# EAGLE design core09ss (EAGLE 6.6.0)

## Sheet 1 of 3
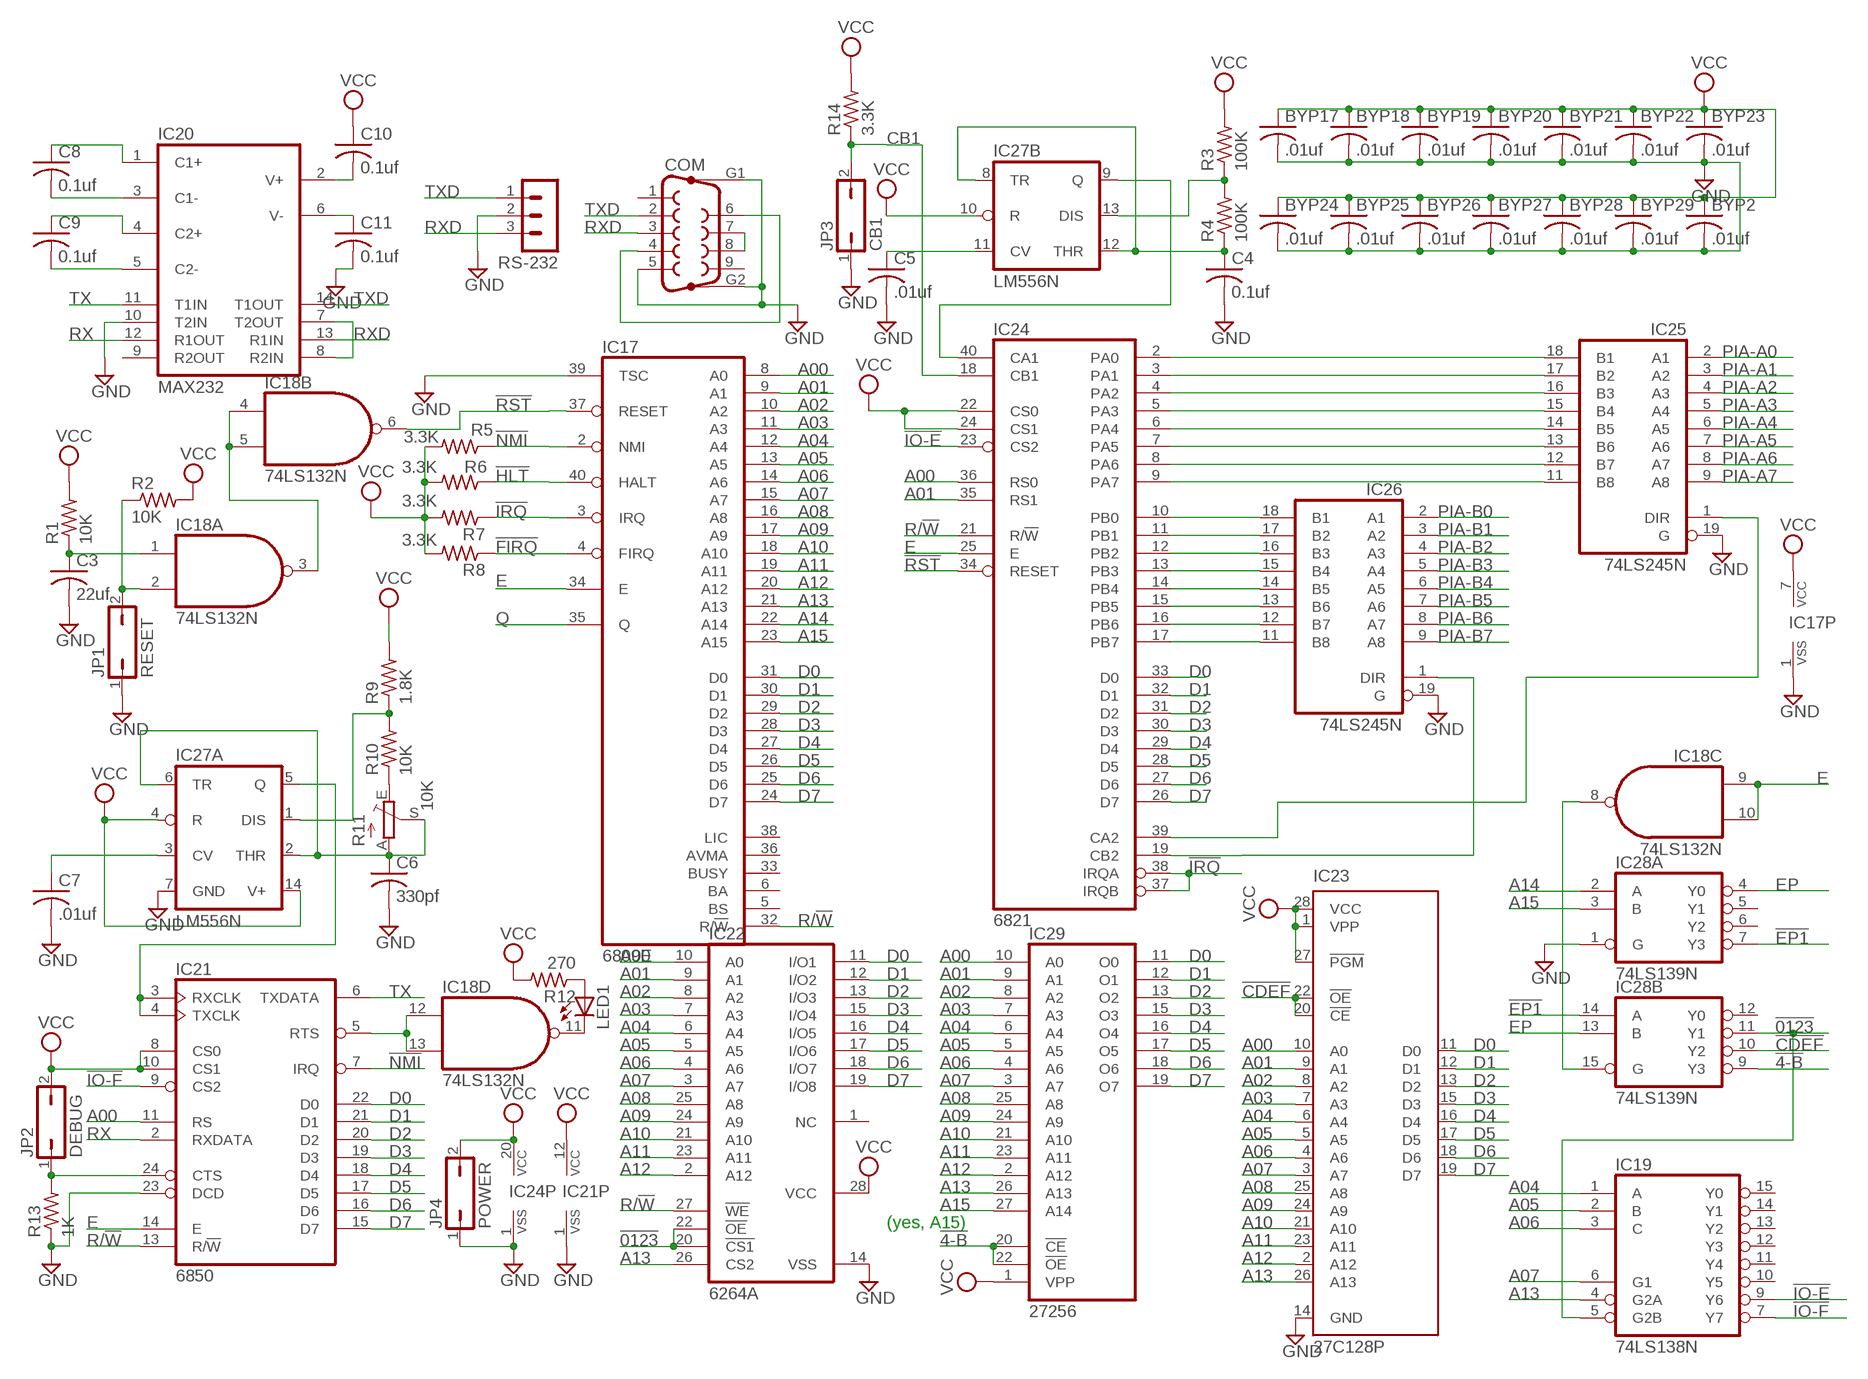
[diagram p0: schematic, sheet 1]

### Parts
BYP2  .01uf  C-US050-025X075  [C050-025X075]
BYP17  .01uf  C-US050-025X075  [C050-025X075]
BYP18  .01uf  C-US050-025X075  [C050-025X075]
BYP19  .01uf  C-US050-025X075  [C050-025X075]
BYP20  .01uf  C-US050-025X075  [C050-025X075]
BYP21  .01uf  C-US050-025X075  [C050-025X075]
BYP22  .01uf  C-US050-025X075  [C050-025X075]
BYP23  .01uf  C-US050-025X075  [C050-025X075]
BYP24  .01uf  C-US050-025X075  [C050-025X075]
BYP25  .01uf  C-US050-025X075  [C050-025X075]
BYP26  .01uf  C-US050-025X075  [C050-025X075]
BYP27  .01uf  C-US050-025X075  [C050-025X075]
BYP28  .01uf  C-US050-025X075  [C050-025X075]
BYP29  .01uf  C-US050-025X075  [C050-025X075]
C3  22uf  C-US102-043X133  [C102-043X133]
C4  0.1uf  C-US050-025X075  [C050-025X075]
C5  .01uf  C-US050-025X075  [C050-025X075]
C6  330pf  C-US050-025X075  [C050-025X075]
C7  .01uf  C-US050-025X075  [C050-025X075]
C8  0.1uf  C-US050-025X075  [C050-025X075]
C9  0.1uf  C-US050-025X075  [C050-025X075]
C10  0.1uf  C-US050-025X075  [C050-025X075]
C11  0.1uf  C-US050-025X075  [C050-025X075]
COM  F09HP  [F09HP]
IC17  6809E  [DIL40]
IC18  74LS132N  74LS00N  [DIL14]
IC19  74LS138N  [DIL16]
IC20  MAX232  [DIL16]
IC21  6850  [DIL24]
IC22  6264A  [DIL28-6]
IC23  27C128P  [DIL28-6]
IC24  6821  [DIL40]
IC25  74LS245N  [DIL20]
IC26  74LS245N  [DIL20]
IC27  LM556N  [DIL14]
IC28  74LS139N  [DIL16]
IC29  27256  [DIL28]
JP1  RESET  JP1Q  [JP1]
JP2  DEBUG  JP1Q  [JP1]
JP3  CB1  JP1Q  [JP1]
JP4  POWER  JP1Q  [JP1]
LED1  LED3MM  [LED3MM]
R1  10K  R-US_0207/7  [0207/7]
R2  10K  R-US_0207/7  [0207/7]
R3  100K  R-US_0207/7  [0207/7]
R4  100K  R-US_0207/7  [0207/7]
R5  3.3K  R-US_0207/7  [0207/7]
R6  3.3K  R-US_0207/7  [0207/7]
R7  3.3K  R-US_0207/7  [0207/7]
R8  3.3K  R-US_0207/7  [0207/7]
R9  1.8K  R-US_0207/7  [0207/7]
R10  10K  R-US_0207/7  [0207/7]
R11  10K  TRIM_EU-B90P  [SP19L]
R12  270  R-US_0207/7  [0207/7]
R13  1K  R-US_0207/7  [0207/7]
R14  3.3K  R-US_0207/7  [0207/7]
RS-232  MA03-1  [MA03-1]

### Nets
!4-B: IC28.9(B:Y3) IC29.20(!CE) IC29.22(!OE)
!0123: IC19.5(G2B) IC22.20(!CS1) IC22.22(!OE) IC28.11(B:Y1)
!CDEF: IC23.20(!CE) IC23.22(!OE) IC28.10(B:Y2)
!EP1: IC28.7(A:Y3) IC28.14(B:A)
!FIRQ: IC17.4(FIRQ) R8.1
!HLT: IC17.40(HALT) R5.1
!IO-E: IC19.9(Y6) IC24.23(CS2)
!IO-F: IC19.7(Y7) IC21.9(CS2)
!IRQ: IC17.3(IRQ) IC24.37(IRQB) IC24.38(IRQA) R7.1
!NMI: IC17.2(NMI) IC21.7(IRQ) R6.1
!RST: IC17.37(RESET) IC18.6(B:O) IC24.34(RESET)
A00: IC17.8(A0) IC21.11(RS) IC22.10(A0) IC23.10(A0) IC24.36(RS0) IC29.10(A0)
A01: IC17.9(A1) IC22.9(A1) IC23.9(A1) IC24.35(RS1) IC29.9(A1)
A02: IC17.10(A2) IC22.8(A2) IC23.8(A2) IC29.8(A2)
A03: IC17.11(A3) IC22.7(A3) IC23.7(A3) IC29.7(A3)
A04: IC17.12(A4) IC19.1(A) IC22.6(A4) IC23.6(A4) IC29.6(A4)
A05: IC17.13(A5) IC19.2(B) IC22.5(A5) IC23.5(A5) IC29.5(A5)
A06: IC17.14(A6) IC19.3(C) IC22.4(A6) IC23.4(A6) IC29.4(A6)
A07: IC17.15(A7) IC19.6(G1) IC22.3(A7) IC23.3(A7) IC29.3(A7)
A08: IC17.16(A8) IC22.25(A8) IC23.25(A8) IC29.25(A8)
A09: IC17.17(A9) IC22.24(A9) IC23.24(A9) IC29.24(A9)
A10: IC17.18(A10) IC22.21(A10) IC23.21(A10) IC29.21(A10)
A11: IC17.19(A11) IC22.23(A11) IC23.23(A11) IC29.23(A11)
A12: IC17.20(A12) IC22.2(A12) IC23.2(A12) IC29.2(A12)
A13: IC17.21(A13) IC19.4(G2A) IC22.26(CS2) IC23.26(A13) IC29.26(A13)
A14: IC17.22(A14) IC28.2(A:A)
A15: IC17.23(A15) IC28.3(A:B) IC29.27(A14)
CB1: IC24.18(CB1) JP3.2 R14.1
D0: IC17.31(D0) IC21.22(D0) IC22.11(I/O1) IC23.11(D0) IC24.33(D0) IC29.11(O0)
D1: IC17.30(D1) IC21.21(D1) IC22.12(I/O2) IC23.12(D1) IC24.32(D1) IC29.12(O1)
D2: IC17.29(D2) IC21.20(D2) IC22.13(I/O3) IC23.13(D2) IC24.31(D2) IC29.13(O2)
D3: IC17.28(D3) IC21.19(D3) IC22.15(I/O4) IC23.15(D3) IC24.30(D3) IC29.15(O3)
D4: IC17.27(D4) IC21.18(D4) IC22.16(I/O5) IC23.16(D4) IC24.29(D4) IC29.16(O4)
D5: IC17.26(D5) IC21.17(D5) IC22.17(I/O6) IC23.17(D5) IC24.28(D5) IC29.17(O5)
D6: IC17.25(D6) IC21.16(D6) IC22.18(I/O7) IC23.18(D6) IC24.27(D6) IC29.18(O6)
D7: IC17.24(D7) IC21.15(D7) IC22.19(I/O8) IC23.19(D7) IC24.26(D7) IC29.19(O7)
E: IC17.34(E) IC18.9(C:I0) IC18.10(C:I1) IC21.14(E) IC24.25(E) ; also sheet 3
EP: IC28.4(A:Y0) IC28.13(B:B)
GND [Power]: BYP2.2 BYP17.2 BYP18.2 BYP19.2 BYP20.2 BYP21.2 BYP22.2 BYP23.2 BYP24.2 BYP25.2 BYP26.2 BYP27.2 BYP28.2 BYP29.2 C3.2 C4.2 C5.2 C6.2 C7.2 C11.2 COM.5 COM.G1 COM.G2 IC17.1(VSS) IC17.39(TSC) IC20.10(T2IN) IC21.1(VSS) IC21.23(DCD) IC22.14(VSS) IC23.14(GND) IC24.1(VSS) IC25.19(G) IC26.19(G) IC27.7(A:GND) IC28.1(A:G) JP1.1 JP3.1 JP4.1 R13.1 RS-232.2 ; also sheet 2,3
N$1: COM.4 COM.6
N$5: IC24.2(PA0) IC25.18(B1)
N$6: IC18.3(A:O) IC18.4(B:I0) IC18.5(B:I1)
N$21: C3.1 IC18.1(A:I0) R1.1
N$22: IC18.2(A:I1) JP1.2 R2.1
N$23: IC21.3(RXCLK) IC21.4(TXCLK) IC27.5(A:Q)
N$24: IC24.10(PB0) IC26.18(B1)
N$25: IC24.11(PB1) IC26.17(B2)
N$27: C6.1 IC27.2(A:THR) IC27.6(A:TR) R11.A R11.S
N$28: IC27.1(A:DIS) R9.1 R10.2
N$94: IC24.12(PB2) IC26.16(B3)
N$124: IC24.13(PB3) IC26.15(B4)
N$125: IC24.14(PB4) IC26.14(B5)
N$126: IC24.15(PB5) IC26.13(B6)
N$127: IC24.16(PB6) IC26.12(B7)
N$128: IC24.17(PB7) IC26.11(B8)
N$129: IC24.3(PA1) IC25.17(B2)
N$130: IC24.4(PA2) IC25.16(B3)
N$131: IC24.5(PA3) IC25.15(B4)
N$132: IC24.6(PA4) IC25.14(B5)
N$133: IC24.7(PA5) IC25.13(B6)
N$134: IC24.8(PA6) IC25.12(B7)
N$135: IC24.9(PA7) IC25.11(B8)
N$136: IC24.19(CB2) IC26.1(DIR)
N$137: IC24.39(CA2) IC25.1(DIR)
N$138: IC24.40(CA1) IC27.9(B:Q)
N$140: C4.1 IC27.8(B:TR) IC27.12(B:THR) R4.1
N$141: IC27.13(B:DIS) R3.1 R4.2
N$142: C5.1 IC27.11(B:CV)
N$143: R10.1 R11.E
N$145: COM.7 COM.8
N$147: IC18.12(D:I0) IC18.13(D:I1) IC21.5(RTS)
N$148: IC18.11(D:O) LED1.K(C)
N$149: LED1.A R12.1
N$150: IC21.24(CTS) JP2.1 R13.2
N$151: IC18.8(C:O) IC28.15(B:G)
N$153: IC20.7(T2OUT) IC20.8(R2IN)
N$154: C7.1 IC27.3(A:CV)
N$155: C9.2 IC20.5(C2-)
N$156: C9.1 IC20.4(C2+)
N$157: C8.2 IC20.3(C1-)
N$158: C8.1 IC20.1(C1+)
N$159: C11.1 IC20.6(V-)
N$160: C10.2 IC20.2(V+)
PIA-A0: IC25.2(A1) ; also sheet 2
PIA-A1: IC25.3(A2) ; also sheet 2
PIA-A2: IC25.4(A3) ; also sheet 2
PIA-A3: IC25.5(A4) ; also sheet 2
PIA-A4: IC25.6(A5) ; also sheet 2
PIA-A5: IC25.7(A6) ; also sheet 2
PIA-A6: IC25.8(A7) ; also sheet 2
PIA-A7: IC25.9(A8) ; also sheet 2
PIA-B0: IC26.2(A1) ; also sheet 2
PIA-B1: IC26.3(A2) ; also sheet 2
PIA-B2: IC26.4(A3) ; also sheet 2
PIA-B3: IC26.5(A4) ; also sheet 2
PIA-B4: IC26.6(A5) ; also sheet 2
PIA-B5: IC26.7(A6) ; also sheet 2
PIA-B6: IC26.8(A7) ; also sheet 2
PIA-B7: IC26.9(A8) ; also sheet 2
Q: IC17.35(Q) ; also sheet 3
R/!W: IC17.32(R/!W) IC21.13(R/!W) IC22.27(!WE) IC24.21(R/!W)
RX: IC20.12(R1OUT) IC21.2(RXDATA)
RXD: COM.3 IC20.13(R1IN) RS-232.3
TX: IC20.11(T1IN) IC21.6(TXDATA)
TXD: COM.2 IC20.14(T1OUT) RS-232.1
VCC [Power]: BYP2.1 BYP17.1 BYP18.1 BYP19.1 BYP20.1 BYP21.1 BYP22.1 BYP23.1 BYP24.1 BYP25.1 BYP26.1 BYP27.1 BYP28.1 BYP29.1 C10.1 IC17.7(VCC) IC21.8(CS0) IC21.10(CS1) IC21.12(VCC) IC22.28(VCC) IC23.1(VPP) IC23.27(!PGM) IC23.28(VCC) IC24.20(VCC) IC24.22(CS0) IC24.24(CS1) IC27.4(A:R) IC27.10(B:R) IC27.14(A:V+) IC29.1(VPP) JP2.2 JP4.2 R1.2 R2.2 R3.2 R5.2 R6.2 R7.2 R8.2 R9.2 R12.2 R14.2 ; also sheet 2,3
Unconnected: COM.1 COM.9 IC17.5(BS) IC17.6(BA) IC17.33(BUSY) IC17.36(AVMA) IC17.38(LIC) IC19.10(Y5) IC19.11(Y4) IC19.12(Y3) IC19.13(Y2) IC19.14(Y1) IC19.15(Y0) IC20.9(R2OUT) IC22.1(NC) IC28.5(A:Y1) IC28.6(A:Y2) IC28.12(B:Y0)

### Notes on the sheet
- (yes, A15)

## Sheet 2 of 3
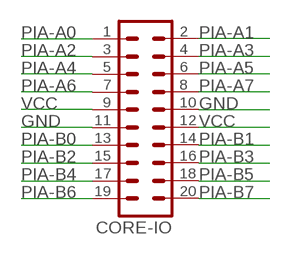
[diagram p1: schematic, sheet 2]

### Parts
CORE-IO  MA10-2  [MA10-2]

### Nets
GND [Power]: CORE-IO.10 CORE-IO.11 ; also sheet 1,3
PIA-A0: CORE-IO.1 ; also sheet 1
PIA-A1: CORE-IO.2 ; also sheet 1
PIA-A2: CORE-IO.3 ; also sheet 1
PIA-A3: CORE-IO.4 ; also sheet 1
PIA-A4: CORE-IO.5 ; also sheet 1
PIA-A5: CORE-IO.6 ; also sheet 1
PIA-A6: CORE-IO.7 ; also sheet 1
PIA-A7: CORE-IO.8 ; also sheet 1
PIA-B0: CORE-IO.13 ; also sheet 1
PIA-B1: CORE-IO.14 ; also sheet 1
PIA-B2: CORE-IO.15 ; also sheet 1
PIA-B3: CORE-IO.16 ; also sheet 1
PIA-B4: CORE-IO.17 ; also sheet 1
PIA-B5: CORE-IO.18 ; also sheet 1
PIA-B6: CORE-IO.19 ; also sheet 1
PIA-B7: CORE-IO.20 ; also sheet 1
VCC [Power]: CORE-IO.9 CORE-IO.12 ; also sheet 1,3

## Sheet 3 of 3
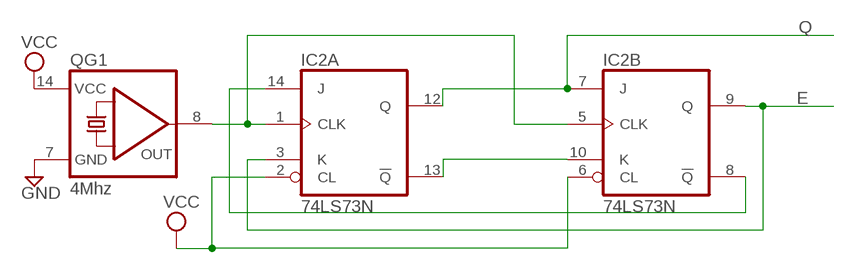
[diagram p2: schematic, sheet 3]

### Parts
IC2  74LS73N  [DIL14]
QG1  4Mhz  QG5860  [DIL14S]

### Nets
E: IC2.3(A:K) IC2.9(B:Q) ; also sheet 1
GND [Power]: QG1.7(GND) ; also sheet 1,2
N$2: IC2.1(A:CLK) IC2.5(B:CLK) QG1.8(OUT)
N$3: IC2.10(B:K) IC2.13(A:!Q)
N$7: IC2.8(B:!Q) IC2.14(A:J)
Q: IC2.7(B:J) IC2.12(A:Q) ; also sheet 1
VCC [Power]: IC2.2(A:CL) IC2.6(B:CL) QG1.14(VCC) ; also sheet 1,2

## Power pins joined to a net without a drawn wire
GND: IC2.11(P:GND) IC18.7(P:GND) IC19.8(GND) IC20.15(GND) IC25.10(GND) IC26.10(GND) IC28.8(P:GND) IC29.14(GND)
VCC: IC2.4(P:VCC) IC18.14(P:VCC) IC19.16(VCC) IC20.16(VCC) IC25.20(VCC) IC26.20(VCC) IC28.16(P:VCC) IC29.28(VCC)

## Library data of the parts
BYP2 BYP17-BYP29 C3-C11 = rcl:C-US: CAPACITOR, American symbol
COM = con-subd:F09HP: SUB-D; OC_FARNELL: unknown; OC_NEWARK: unknown
CORE-IO = con-lstb:MA10-2: PIN HEADER; OC_FARNELL: unknown; OC_NEWARK: unknown
IC2 = 74xx-us:74*73: Dual J-K FLIP FLOP, clear
IC17 = micro-motorola:6809E: MICROCONTROLLER/MEMORY DEVICE; MF: NTE ELECTRONICS; MPN: NTE6809E; OC_FARNELL: unknown; OC_NEWARK: 31C5318
IC18 = 74xx-us:74*00: Quad 2-input NAND gate
IC19 = 74xx-us:74*138: 3-line to 8-line DECODER/DEMULTIPLEXER
IC20 = maxim:MAX232: RS232 TRANSCEIVER; MF: MAXIM; MPN: MAX232ACPE+; OC_FARNELL: 9723773; OC_NEWARK: 68K4544
IC21 = micro-motorola:6850: MICROCONTROLLER/MEMORY DEVICE; MF: NTE ELECTRONICS; MPN: NTE6850; OC_FARNELL: 4899775; OC_NEWARK: 31C2457
IC22 = memory-hitachi:6264A: MEMORY; OC_FARNELL: 283605; OC_NEWARK: unknown
IC23 = microchip:27*128: CMOS EPROM 128 K (16 K x 8); OC_FARNELL: unknown; OC_NEWARK: unknown
IC24 = micro-motorola:6821: MICROCONTROLLER/MEMORY DEVICE; MF: NTE ELECTRONICS; MPN: NTE6821; OC_FARNELL: 1652403; OC_NEWARK: 29C4772
IC25 IC26 = 74xx-us:74*245: Octal BUS TRANSCEIVER, 3-state
IC27 = linear:*556: Dual TIMER
IC28 = 74xx-us:74*139: Dual 2-line to 4-line DECODER/DEMULTIPLEXER
IC29 = memory:27256: MEMORY
JP1-JP4 = jumper:JP1Q: JUMPER
LED1 = led:LED: LED OSRAM: - CHIPLED LG R971, LG N971, LY N971, LG Q971, LY Q971, LO R971, LY R971 LH N974, LH R974 LS Q976, LO Q976, LY Q976 LO Q996 - Hyper CHIPLED LW Q18S LB Q993, LB Q99A, LB R99A - SideLED LS A670, LO A670, LY A670, LG A670, LP A670 LB A673, LV A673, LT A673, LW A673 LH A674 LY A675 LS A676, LA A676, LO A676, LY A676, LW A676 LS A679, LY A679, LG A679 - Hyper Micro SIDELED® LS Y876, LA Y876, LO Y876, LY Y876 LT Y87S - SmartLED LW L88C, LW L88S LB L89C, LB L89S, LG L890 LS L89K, LO L89K, LY L89K LS L896, LA L896, LO L896, LY L896 - TOPLED LS T670, LO T670, LY T670, LG T670, LP T670 LSG T670, LSP T670, LSY T670, LOP T670, LYG T670 LG T671, LOG T671, LSG T671 LB T673, LV T673, LT T673, LW T673 LH T674 LS T676, LA T676, LO T676, LY T676, LB T676, LH T676, LSB T676, LW T676 LB T67C, LV T67C, LT T67C, LS T67K, LO T67K, LY T67K, LW E67C LS E67B, LA E67B, LO E67B, LY E67B, LB E67C, LV E67C, LT E67C LW T67C LS T679, LY T679, LG T679 LS T770, LO T770, LY T770, LG T770, LP T770 LB T773, LV T773, LT T773, LW T773 LH T774 LS E675, LA E675, LY E675, LS T675 LS T776, LA T776, LO T776, LY T776, LB T776 LHGB T686 LT T68C, LB T68C - Hyper Mini TOPLED® LB M676 - Mini TOPLED Santana® LG M470 LS M47K, LO M47K, LY M47K Source: http://www.osram.convergy.de LUXEON: - LUMILED® LXK2-PW12-R00, LXK2-PW12-S00, LXK2-PW14-U00, LXK2-PW14-V00 LXK2-PM12-R00, LXK2-PM12-S00, LXK2-PM14-U00 LXK2-PE12-Q00, LXK2-PE12-R00, LXK2-PE12-S00, LXK2-PE14-T00, LXK2-PE14-U00 LXK2-PB12-K00, LXK2-PB12-L00, LXK2-PB12-M00, LXK2-PB14-N00, LXK2-PB14-P00, LXK2-PB14-Q00 LXK2-PR12-L00, LXK2-PR12-M00, LXK2-PR14-Q00, LXK2-PR14-R00 LXK2-PD12-Q00, LXK2-PD12-R00, LXK2-PD12-S00 LXK2-PH12-R00, LXK2-PH12-S00 LXK2-PL12-P00, LXK2-PL12-Q00, LXK2-PL12-R00 Source: www.luxeon.com KINGBRIGHT: KA-3528ASYC Source: www.kingbright.com
QG1 = crystal:QG5860: CRYSTAL RESONATOR; OC_FARNELL: unknown; OC_NEWARK: unknown
R1-R10 R12-R14 = rcl:R-US_: RESISTOR, American symbol
R11 = pot:TRIM_EU-: POTENTIOMETER
RS-232 = con-lstb:MA03-1: PIN HEADER; OC_FARNELL: unknown; OC_NEWARK: unknown

## Net classes
1 Power: width 0.508 mm, drill 0.254 mm, clearance 0.254 mm

## Board
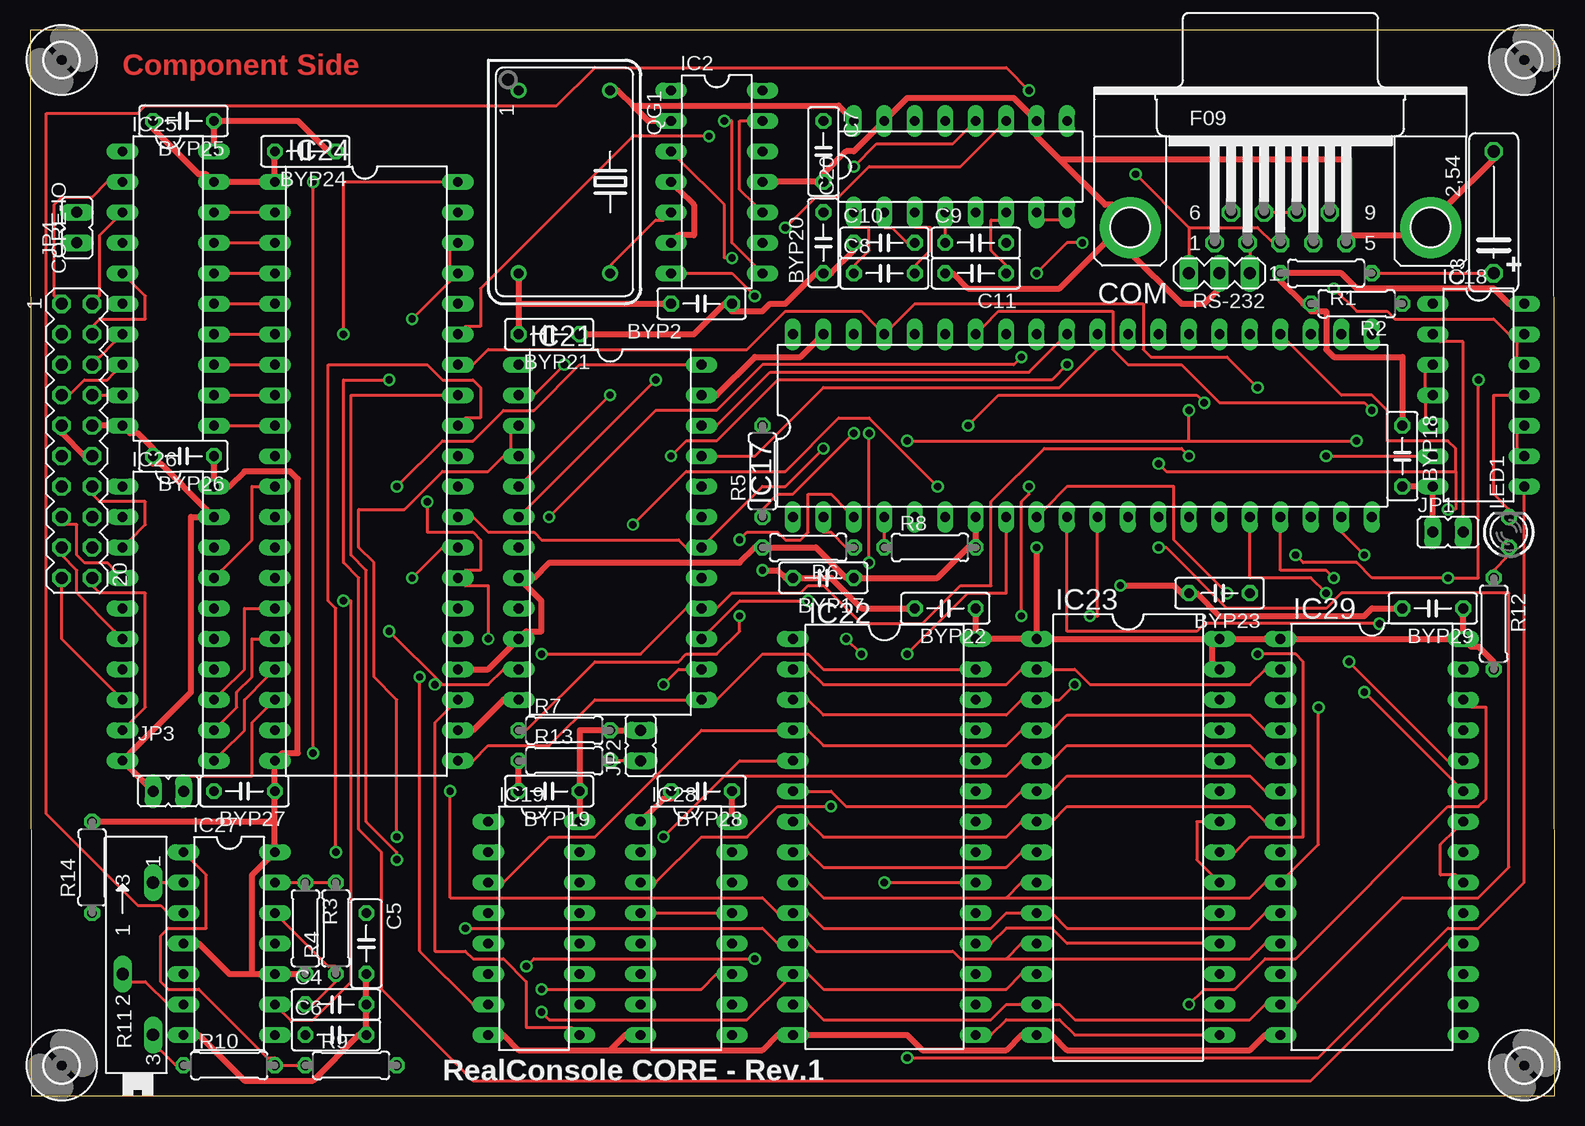
[diagram p3: board, top side]
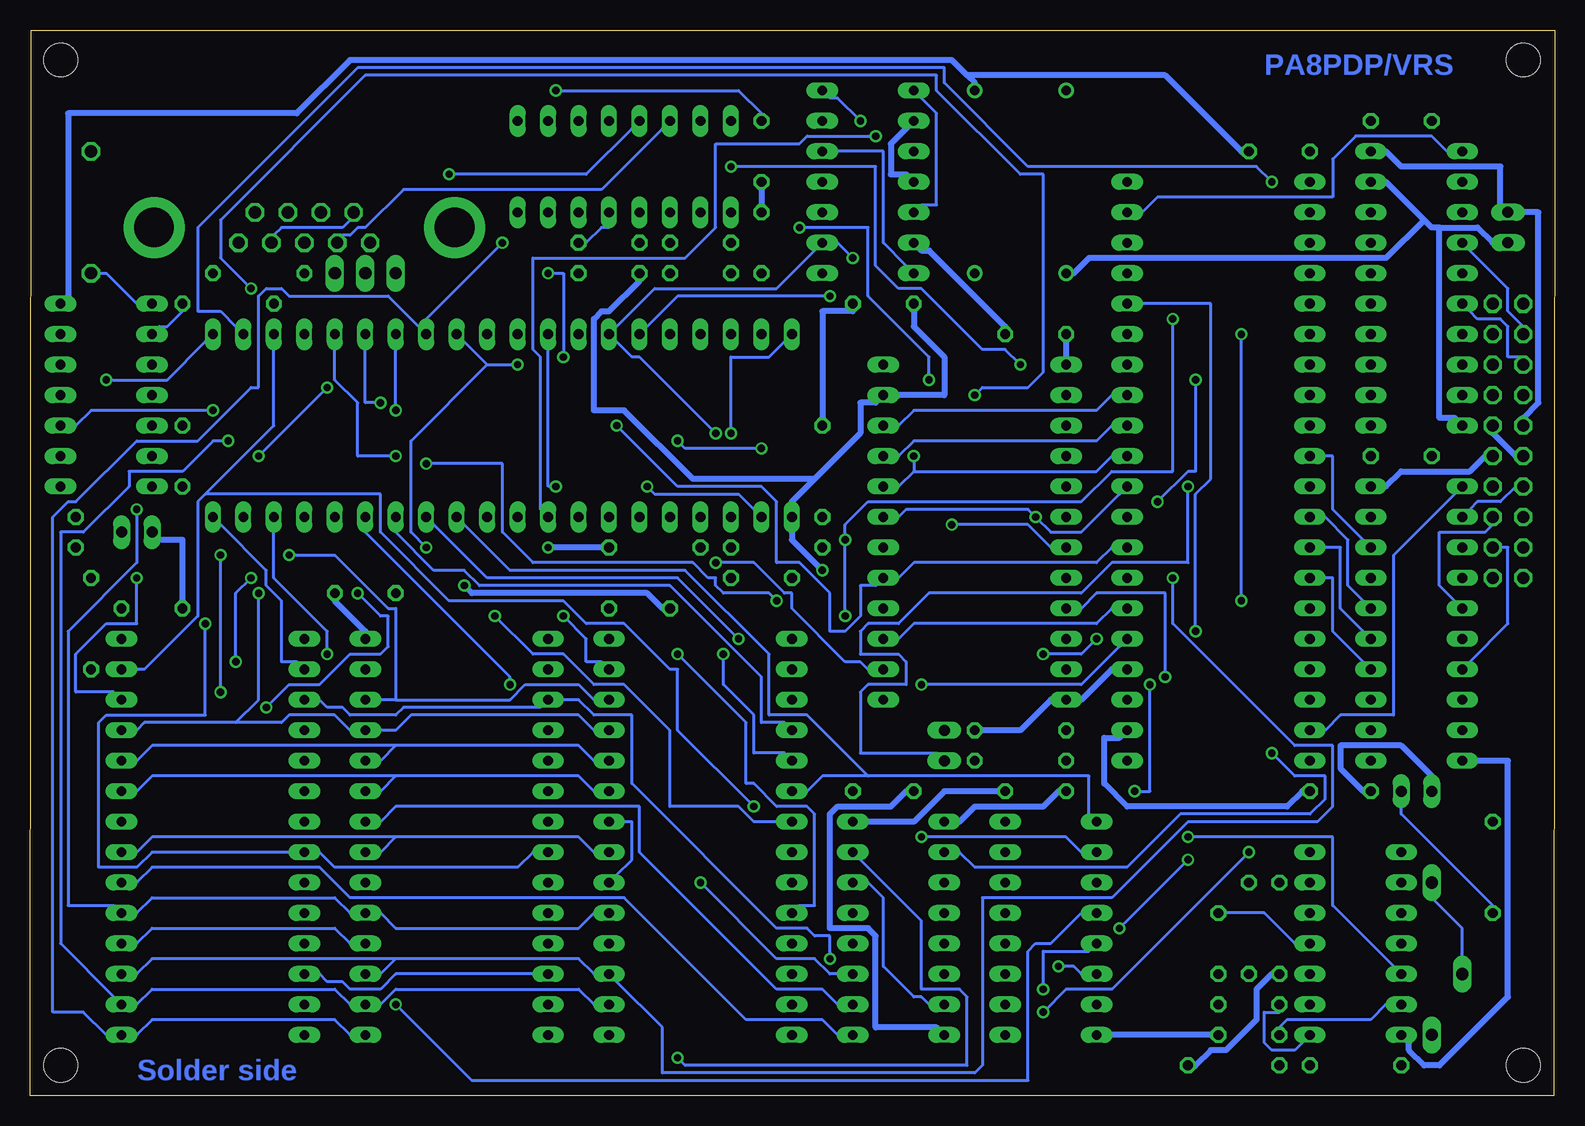
[diagram p4: board, bottom side, seen from below]

Size 127.11 x 88.87 mm. Coordinates in mm from the lower left corner, seen from the top.
Outline: 0.1,0 127.11,0 127.01,88.87 0,88.87 0.1,0
Copper layers (1*16): Top 0.035mm / dielectric 1.5mm / Bottom 0.035mm
Design rules "olimex10mil": minimum track width 10mil, minimum drill 24mil, track to track 10mil, track to pad 10mil, pad to pad 10mil, via to via 10mil, smd to smd 10mil, copper to edge 40mil, drill to drill 10mil, minimum pad ring 10mil, minimum via ring 8mil, stop-mask expansion 0mil, vias tented up to drill 0mil, thermal gap 10mil

### Footprints (pad centres in the part's own frame; a part is rotated, then mirrored left to right if it is on the bottom)
C050-025X075 = drill 0.813 octagon: 1 -2.54,0; 2 2.54,0
C102-043X133 = drill 1.016 octagon: 1 -5.08,0; 2 5.08,0
F09HP = drill 1.016 octagon: 1 -5.486,-1.27; 2 -2.743,-1.27; 3 0,-1.27; 4 2.743,-1.27; 5 5.486,-1.27; 6 -4.115,1.27; 7 -1.372,1.27; 8 1.372,1.27; 9 4.115,1.27 | drill 3.302 pad 5.08: G1 -12.522,0; G2 12.522,0
MA10-2 = drill 1.016 octagon: 1 -11.43,-1.27; 2 -11.43,1.27; 3 -8.89,-1.27; 4 -8.89,1.27; 5 -6.35,-1.27; 6 -6.35,1.27; 7 -3.81,-1.27; 8 -3.81,1.27; 9 -1.27,-1.27; 10 -1.27,1.27; 11 1.27,-1.27; 12 1.27,1.27; 13 3.81,-1.27; 14 3.81,1.27; 15 6.35,-1.27; 16 6.35,1.27; 17 8.89,-1.27; 18 8.89,1.27; 19 11.43,-1.27; 20 11.43,1.27
DIL14 = drill 0.813 long: 1 -7.62,-3.81; 2 -5.08,-3.81; 3 -2.54,-3.81; 4 0,-3.81; 5 2.54,-3.81; 6 5.08,-3.81; 7 7.62,-3.81; 8 7.62,3.81; 9 5.08,3.81; 10 2.54,3.81; 11 0,3.81; 12 -2.54,3.81; 13 -5.08,3.81; 14 -7.62,3.81
DIL40 = drill 0.813 long: 1 -24.13,-7.62; 2 -21.59,-7.62; 3 -19.05,-7.62; 4 -16.51,-7.62; 5 -13.97,-7.62; 6 -11.43,-7.62; 7 -8.89,-7.62; 8 -6.35,-7.62; 9 -3.81,-7.62; 10 -1.27,-7.62; 11 1.27,-7.62; 12 3.81,-7.62; 13 6.35,-7.62; 14 8.89,-7.62; 15 11.43,-7.62; 16 13.97,-7.62; 17 16.51,-7.62; 18 19.05,-7.62; 19 21.59,-7.62; 20 24.13,-7.62; 21 24.13,7.62; 22 21.59,7.62; 23 19.05,7.62; 24 16.51,7.62; 25 13.97,7.62; 26 11.43,7.62; 27 8.89,7.62; 28 6.35,7.62; 29 3.81,7.62; 30 1.27,7.62; 31 -1.27,7.62; 32 -3.81,7.62; 33 -6.35,7.62; 34 -8.89,7.62; 35 -11.43,7.62; 36 -13.97,7.62; 37 -16.51,7.62; 38 -19.05,7.62; 39 -21.59,7.62; 40 -24.13,7.62
DIL16 = drill 0.813 long: 1 -8.89,-3.81; 2 -6.35,-3.81; 3 -3.81,-3.81; 4 -1.27,-3.81; 5 1.27,-3.81; 6 3.81,-3.81; 7 6.35,-3.81; 8 8.89,-3.81; 9 8.89,3.81; 10 6.35,3.81; 11 3.81,3.81; 12 1.27,3.81; 13 -1.27,3.81; 14 -3.81,3.81; 15 -6.35,3.81; 16 -8.89,3.81
DIL24 = drill 0.813 long: 1 -13.97,-7.62; 2 -11.43,-7.62; 3 -8.89,-7.62; 4 -6.35,-7.62; 5 -3.81,-7.62; 6 -1.27,-7.62; 7 1.27,-7.62; 8 3.81,-7.62; 9 6.35,-7.62; 10 8.89,-7.62; 11 11.43,-7.62; 12 13.97,-7.62; 13 13.97,7.62; 14 11.43,7.62; 15 8.89,7.62; 16 6.35,7.62; 17 3.81,7.62; 18 1.27,7.62; 19 -1.27,7.62; 20 -3.81,7.62; 21 -6.35,7.62; 22 -8.89,7.62; 23 -11.43,7.62; 24 -13.97,7.62
DIL28-6 = drill 0.813 long: 1 -16.51,-7.62; 2 -13.97,-7.62; 3 -11.43,-7.62; 4 -8.89,-7.62; 5 -6.35,-7.62; 6 -3.81,-7.62; 7 -1.27,-7.62; 8 1.27,-7.62; 9 3.81,-7.62; 10 6.35,-7.62; 11 8.89,-7.62; 12 11.43,-7.62; 13 13.97,-7.62; 14 16.51,-7.62; 15 16.51,7.62; 16 13.97,7.62; 17 11.43,7.62; 18 8.89,7.62; 19 6.35,7.62; 20 3.81,7.62; 21 1.27,7.62; 22 -1.27,7.62; 23 -3.81,7.62; 24 -6.35,7.62; 25 -8.89,7.62; 26 -11.43,7.62; 27 -13.97,7.62; 28 -16.51,7.62
DIL20 = drill 0.813 long: 1 -11.43,-3.81; 2 -8.89,-3.81; 3 -6.35,-3.81; 4 -3.81,-3.81; 5 -1.27,-3.81; 6 1.27,-3.81; 7 3.81,-3.81; 8 6.35,-3.81; 9 8.89,-3.81; 10 11.43,-3.81; 11 11.43,3.81; 12 8.89,3.81; 13 6.35,3.81; 14 3.81,3.81; 15 1.27,3.81; 16 -1.27,3.81; 17 -3.81,3.81; 18 -6.35,3.81; 19 -8.89,3.81; 20 -11.43,3.81
DIL28 = drill 0.813 long: 1 -16.51,-7.62; 2 -13.97,-7.62; 3 -11.43,-7.62; 4 -8.89,-7.62; 5 -6.35,-7.62; 6 -3.81,-7.62; 7 -1.27,-7.62; 8 1.27,-7.62; 9 3.81,-7.62; 10 6.35,-7.62; 11 8.89,-7.62; 12 11.43,-7.62; 13 13.97,-7.62; 14 16.51,-7.62; 15 16.51,7.62; 16 13.97,7.62; 17 11.43,7.62; 18 8.89,7.62; 19 6.35,7.62; 20 3.81,7.62; 21 1.27,7.62; 22 -1.27,7.62; 23 -3.81,7.62; 24 -6.35,7.62; 25 -8.89,7.62; 26 -11.43,7.62; 27 -13.97,7.62; 28 -16.51,7.62
JP1 = drill 0.914 long: 1 0,-1.27; 2 0,1.27
LED3MM = drill 0.813 octagon: A -1.27,0; K 1.27,0
DIL14S = drill 0.813: 1 -7.62,-3.81; 7 7.62,-3.81; 8 7.62,3.81; 14 -7.62,3.81
0207/7 = drill 0.813 octagon: 1 -3.81,0; 2 3.81,0
SP19L = drill 1.016 long: A 5.715,-1.27; E -6.985,-1.27; S -1.905,1.27
MA03-1 = drill 1.016 long: 1 -2.54,0; 2 0,0; 3 2.54,0
2,8 = hole 2.8: 0,0

### Placement (x,y rotation side)
BYP2  55.98,66.05 180 top
BYP17  66.14,43.19 180 top
BYP18  114.4,53.35 270 top
BYP19  43.28,25.41 180 top
BYP20  66.14,71.13 90 top
BYP21  43.28,63.51 180 top
BYP22  76.3,40.65 180 top
BYP23  99.16,41.92 180 top
BYP24  22.96,78.75 180 top
BYP25  12.8,81.29 180 top
BYP26  12.8,53.35 180 top
BYP27  17.88,25.41 180 top
BYP28  55.98,25.41 180 top
BYP29  116.94,40.65 180 top
C3  122.02,73.67 90 top
C4  25.5,7.63 0 top
C5  28.04,12.71 270 top
C6  25.5,5.09 0 top
C7  66.14,78.75 270 top
C8  71.22,68.59 0 top
C9  78.84,71.13 0 top
C10  71.22,71.13 0 top
C11  78.84,68.59 180 top
COM  104.24,72.4 0 top
CORE-IO  3.91,54.62 270 top
IC2  57.25,76.21 270 top
IC17  87.73,55.89 0 top
IC18  120.75,58.43 270 top
IC19  42.01,13.98 270 top
IC20  77.57,77.48 0 top
IC21  48.36,47 270 top
IC22  71.22,21.6 270 top
IC23  91.54,21.6 270 top
IC24  28.04,52.08 270 top
IC25  11.53,67.32 270 top
IC26  11.53,39.38 270 top
IC27  16.61,12.71 270 top
IC28  54.71,13.98 270 top
IC29  111.86,21.6 270 top
JP1  118.21,47 270 top
JP2  50.9,29.22 0 top
JP3  11.53,25.41 270 top
JP4  3.91,72.4 0 top
LED1  123.29,47 90 top
QG1  44.55,76.21 270 top
R1  108.05,68.59 180 top
R2  110.59,66.05 180 top
R3  22.96,13.98 270 top
R4  25.5,13.98 90 top
R5  61.06,52.08 90 top
R6  64.87,45.73 180 top
R7  44.55,30.49 0 top
R8  75.03,45.73 0 top
R9  26.77,2.55 0 top
R10  16.61,2.55 0 top
R11  8.99,12.08 90 top
R12  122.02,39.38 270 top
R13  44.55,27.95 0 top
R14  5.18,19.06 90 top
RS-232  99.16,68.59 180 top
U$3  [2,8]  2.64,86.37 0 top
U$4  [2,8]  2.64,2.55 0 top
U$5  [2,8]  124.56,86.37 0 top
U$6  [2,8]  124.56,2.55 0 top

### Tracks (layer width: path | path; a pad name or v marks a point on that pad's centre or on a via)
!4-B
  Top 0.254: IC29.22 118.84,22.24 117.57,20.97 117.57,18.43 118.84,18.43 IC29.20
  Bottom 0.254: IC28.9 59.79,5.09 61.06,6.36 67.41,6.36 77.57,16.52 100.43,16.52 102.97,19.06 116.94,19.06 118.21,17.79 IC29.20
!0123  (via drill 0.61)
  Top 0.254: v42.64,8.9 55.98,8.9 57.25,10.17 IC28.11 | v71.22,17.79 77.57,17.79 IC22.20
  Bottom 0.254: IC22.20 78.2,18.43 76.93,19.7 76.93,22.87 77.57,22.87 IC22.22 | v42.64,8.9 42.64,12.08 38.83,12.08 IC19.5 | v71.22,17.79 64.87,11.44 61.69,11.44 60.42,10.17 59.79,10.17 IC28.11
!CDEF
  Top 0.254: IC23.20 98.52,18.43 97.25,19.7 97.25,22.87 97.89,22.87 IC23.22
  Bottom 0.254: IC28.10 59.79,7.63 61.06,8.9 64.87,8.9 76.3,20.33 76.3,24.14 96.62,24.14 97.89,22.87 IC23.22
!EP1
  Bottom 0.254: IC28.7 52.17,7.63 52.8,8.27 53.44,8.27 55.98,10.81 55.98,16.52 57.25,17.79 IC28.14
!FIRQ
  Top 0.254: R8.1 71.22,46.37 71.22,47 IC17.4
!HLT  (via drill 0.61)
  Top 0.254: v68.68,55.26 63.6,50.18 62.33,50.18 61.06,48.91 R5.1
  Bottom 0.254: v68.68,55.26 68.68,61.61 65.5,61.61 64.23,62.88 IC17.40
!IO-E
  Top 0.254: IC24.23 35.02,32.4 33.75,31.13 33.75,12.08 36.29,12.08 36.93,11.44 39.47,11.44 41.37,9.54 41.37,5.73 45.18,5.73 IC19.9
!IO-F  (via drill 0.61)
  Top 0.254: v32.48,34.94 32.48,12.08 36.93,7.63 IC19.7
  Bottom 0.254: v32.48,34.94 32.48,41.92 38.2,41.92 39.47,40.65 IC21.9
!IRQ  (via drill 0.61)
  Top 0.254: IC24.38 35.02,70.5 35.02,69.23 IC24.37 35.02,67.96 v31.85,64.78 | v59.15,40.02 59.15,38.75 57.25,36.84 54.71,36.84 54.07,36.21 47.09,36.21 41.37,30.49 R7.1 | v59.15,46.37 59.79,47 62.33,47 62.96,46.37 64.23,46.37 64.87,47 64.87,50.18 66.77,50.18 68.04,48.91 IC17.3
  Bottom 0.254: v59.15,40.02 v59.15,46.37 59.15,47.64 57.25,49.54 39.47,49.54 36.93,52.08 31.85,52.08 v31.85,64.78
!NMI  (via drill 0.61)
  Top 0.254: v50.26,47.64 54.71,52.08 62.96,52.08 67.41,56.53 69.95,56.53 v75.66,50.81 | R6.1 68.04,45.73 66.77,47 66.14,47 IC17.2
  Bottom 0.254: v50.26,47.64 43.91,47.64 42.01,45.73 IC21.7 | v75.66,50.81 75.03,50.18 68.04,50.18 66.77,48.91 IC17.2
!RST  (via drill 0.61)
  Top 0.254: IC24.34 36.93,60.97 38.2,62.24 59.79,62.24 62.96,65.42 69.31,65.42 70.58,64.15 IC17.37 71.85,64.15 73.76,66.05 92.81,66.05 92.81,62.24 93.44,61.61 99.79,61.61 v102.33,59.07 | v108.05,53.35 115.67,53.35 IC18.6
  Bottom 0.254: v102.33,59.07 v108.05,53.35
A00  (via drill 0.61)
  Top 0.254: 34.39,34.3 38.2,34.3 39.47,35.57 IC21.11 | 34.39,34.3 v29.94,38.75 | v73.12,36.84 78.2,41.92 81.38,41.92 81.38,47 IC17.8 | IC29.10 102.97,15.25 101.7,13.98 86.46,13.98 85.19,15.25 IC23.10 82.65,15.25 81.38,15.25 80.11,13.98 66.14,13.98 64.87,15.25 IC22.10 62.33,15.25 61.06,16.52 35.02,16.52 v35.02,25.41 | v33.75,34.3 34.39,34.3
  Bottom 0.254: v29.94,38.75 29.94,50.18 28.67,51.45 28.67,66.05 34.39,66.05 IC24.36 | v73.12,36.84 67.41,31.13 67.41,26.05 66.77,26.05 64.87,24.14 62.33,24.14 61.69,23.51 61.69,15.89 62.96,15.89 IC22.10 | v33.75,34.3 33.75,25.41 v35.02,25.41
A01  (via drill 0.61)
  Top 0.254: 81.38,16.52 66.14,16.52 64.87,17.79 IC22.9 | 81.38,16.52 82.65,17.79 IC23.9 | 81.38,16.52 101.7,16.52 102.97,17.79 IC29.9 104.87,18.43 107.41,20.97 v107.41,32.4 | v56.61,80.02 50.26,80.02 37.56,67.32 37.56,64.15 36.29,64.15 IC24.35 | v99.79,41.92 95.35,46.37 95.35,50.81 86.46,50.81 84.55,48.91 IC17.9
  Bottom 0.254: v56.61,80.02 62.33,80.02 62.96,79.39 69.95,79.39 69.95,72.4 72.49,69.86 85.19,69.86 85.19,62.24 84.55,61.61 84.55,48.91 IC17.9 | v107.41,32.4 105.51,34.3 102.97,34.3 100.43,36.84 97.89,36.84 97.25,37.48 97.25,40.02 97.89,40.02 v99.79,41.92
A02  (via drill 0.61)
  Top 0.254: IC22.8 64.87,20.33 66.14,19.06 81.38,19.06 82.65,20.33 IC23.8 | v112.49,39.38 97.89,39.38 97.25,38.75 86.46,38.75 86.46,47 IC17.10
  Bottom 0.254: IC23.8 85.19,20.33 86.46,19.06 101.7,19.06 102.97,20.33 IC29.8 105.51,20.33 116.94,20.33 118.21,19.06 121.38,19.06 121.38,31.13 120.75,31.76 112.49,31.76 v112.49,39.38
A03  (via drill 0.61)
  Top 0.254: IC22.7 64.87,22.87 66.14,21.6 81.38,21.6 82.65,22.87 IC23.7 85.19,22.87 86.46,24.14 101.7,24.14 102.97,22.87 IC29.7 | v88.36,40.02 89,40.02 89,47 IC17.11
  Bottom 0.254: v88.36,40.02 85.19,36.84 82.65,36.84 80.11,34.3 77.57,34.3 73.76,30.49 73.76,24.14 68.04,24.14 66.77,22.87 64.87,22.87 IC22.7
A04
  Top 0.254: IC29.6 102.97,25.41 101.7,26.68 86.46,26.68 85.19,25.41 IC23.6 82.65,25.41 81.38,24.14 68.04,24.14 66.77,25.41 64.87,25.41 IC22.6
  Bottom 0.254: 57.25,26.68 61.06,26.68 62.33,25.41 IC22.6 | 57.25,26.68 38.83,26.68 38.83,23.51 IC19.1 | 57.25,26.68 62.33,31.76 65.5,31.76 65.5,36.84 72.49,43.83 87.09,43.83 90.9,47.64 IC17.12
A05  (via drill 0.61)
  Top 0.254: 57.88,26.68 59.15,27.95 62.33,27.95 IC22.5 | v52.8,21.6 57.88,26.68 | 57.88,26.68 81.38,26.68 82.65,27.95 IC23.5 85.19,27.95 86.46,29.22 101.7,29.22 102.97,27.95 IC29.5 | v69.31,36.84 v68.04,38.11
  Bottom 0.254: v52.8,21.6 40.74,21.6 39.47,20.33 IC19.2 | v68.04,38.11 73.12,43.19 89,43.19 93.44,47.64 IC17.13 | v69.31,36.84 69.31,34.3 66.77,31.76 66.77,28.59 64.23,28.59 IC22.5
A06
  Top 0.254: IC19.3 39.47,17.79 43.28,21.6 47.09,21.6 55.98,30.49 62.33,30.49 IC22.4 64.87,30.49 66.14,29.22 81.38,29.22 82.65,30.49 IC23.4 85.19,30.49 86.46,31.76 101.7,31.76 102.97,30.49 IC29.4
  Bottom 0.254: IC17.14 96.62,47 93.44,43.83 90.9,43.83 89.63,42.56 73.76,42.56 66.14,34.94 66.14,31.13 64.23,31.13 IC22.4
A07  (via drill 0.61)
  Top 0.254: v41.37,10.81 42.01,11.44 v60.42,11.44 | IC22.3 64.87,33.03 66.14,31.76 81.38,31.76 82.65,33.03 IC23.3 85.19,33.03 85.82,33.03 v87.09,34.3
  Bottom 0.254: v41.37,10.81 40.1,10.81 39.47,10.17 IC19.6 | v60.42,11.44 60.42,13.35 61.69,13.35 62.33,13.98 64.87,13.98 76.93,26.05 76.93,31.76 80.11,31.76 81.38,33.03 82.65,33.03 IC23.3 84.55,32.4 95.98,32.4 96.62,31.76 100.43,31.76 101.06,32.4 102.33,32.4 102.97,33.03 IC29.3 | v87.09,34.3 87.09,34.94 99.16,47 IC17.15
A08  (via drill 0.61)
  Top 0.254: v108.05,41.92 106.78,43.19 101.7,43.19 101.7,47 IC17.16
  Bottom 0.254: IC22.25 80.11,30.49 81.38,31.76 95.35,31.76 96.62,30.49 97.89,30.49 IC23.25 100.43,30.49 101.7,31.76 105.51,31.76 106.14,31.13 109.95,31.13 | 109.95,31.13 117.57,31.13 118.21,30.49 IC29.25 | v108.05,41.92 108.05,33.03 109.95,31.13
A09  (via drill 0.61)
  Top 0.254: v108.68,43.19 108.05,43.83 104.24,43.83 104.24,47 IC17.17 | v109.95,36.21 118.21,27.95 IC29.24
  Bottom 0.254: 96.62,29.22 81.38,29.22 80.11,27.95 IC22.24 | 96.62,29.22 97.89,27.95 IC23.24 | 96.62,29.22 116.94,29.22 118.21,27.95 IC29.24 | v108.68,43.19 109.95,41.92 v109.95,36.21
A10  (via drill 0.61)
  Top 0.254: v102.33,36.84 105.51,36.84 106.14,36.21 106.14,21.6 101.7,21.6 100.43,20.33 IC23.21
  Bottom 0.254: 96.62,21.6 81.38,21.6 80.11,20.33 IC22.21 | 96.62,21.6 97.89,20.33 IC23.21 | 96.62,21.6 116.94,21.6 118.21,20.33 IC29.21 | v102.33,36.84 102.33,38.75 106.78,43.19 106.78,47 IC17.18
A11  (via drill 0.61)
  Top 0.254: v111.22,45.1 109.32,47 IC17.19 | v111.22,33.67 118.84,26.05 IC29.23
  Bottom 0.254: 96.62,26.68 81.38,26.68 80.11,25.41 IC22.23 | 96.62,26.68 97.89,25.41 IC23.23 | 96.62,26.68 116.94,26.68 118.21,25.41 IC29.23 | v111.22,33.67 v111.22,45.1
A12
  Top 0.254: IC22.2 64.87,35.57 66.14,34.3 81.38,34.3 82.65,35.57 IC23.2 85.19,35.57 87.09,35.57 88.36,34.3 101.7,34.3 102.97,35.57 IC29.2
  Bottom 0.254: IC17.20 111.22,47.64 107.41,43.83 107.41,42.56 106.14,41.29 106.14,36.21 104.87,36.21 IC29.2
A13  (via drill 0.61)
  Top 0.254: v96.62,7.63 97.89,8.9 100.43,8.9 102.97,11.44 105.51,11.44 118.21,24.14 120.75,24.14 121.38,24.78 121.38,32.4 120.11,32.4 IC29.26 | v120.75,59.7 120.75,43.19 v118.21,43.19 111.86,43.19 110.59,44.46 106.14,44.46 v105.51,45.1
  Bottom 0.254: 96.62,33.03 97.89,33.03 IC23.26 | 96.62,33.03 87.09,33.03 85.82,34.3 81.38,34.3 80.11,33.03 IC22.26 | v96.62,7.63 90.27,1.28 43.91,1.28 43.91,12.08 43.28,12.71 42.01,12.71 39.47,15.25 IC19.4 | v120.75,59.7 115.67,59.7 112.49,62.88 IC17.21 | v118.21,43.19 118.21,39.38 120.75,39.38 123.29,36.84 123.29,33.67 120.11,33.67 IC29.26 | 96.62,33.03 96.62,40.65 97.25,40.65 101.7,45.1 v105.51,45.1
A14  (via drill 0.61)
  Top 0.254: v23.59,28.59 v23.59,76.21
  Bottom 0.254: v23.59,28.59 21.69,26.68 19.15,26.68 19.15,24.78 20.42,23.51 31.21,23.51 35.66,19.06 48.36,19.06 49.63,20.33 IC28.2 | v23.59,76.21 24.86,77.48 43.91,77.48 50.9,84.47 50.9,85.74 99.79,85.74 113.13,72.4 113.13,65.42 111.22,65.42 109.95,64.15 IC17.22
A15  (via drill 0.61)
  Top 0.254: v66.77,24.14 62.33,24.14 59.79,21.6 55.98,21.6 52.17,17.79 IC28.3
  Bottom 0.254: v66.77,24.14 73.12,30.49 73.12,35.57 73.76,35.57 77.57,39.38 80.74,39.38 82.65,41.29 92.17,41.29 97.89,47 97.89,50.18 112.49,50.18 | 112.49,50.18 113.13,49.54 113.13,40.02 117.57,35.57 118.21,35.57 IC29.27 | 112.49,50.18 106.78,55.89 106.78,62.24 IC17.23
CB1
  Top 0.254: IC24.18 19.78,32.4 18.51,31.13 18.51,26.68 12.8,26.68 JP3.2
  Bottom 0.254: R14.1 5.18,15.89 12.8,23.51 12.8,24.14 JP3.2
D0  (via drill 0.61)
  Top 0.254: 81.38,11.44 77.57,11.44 76.93,12.08 65.5,12.08 64.87,12.71 IC22.11 62.33,12.71 61.06,13.98 v36.29,13.98 | 81.38,11.44 82.65,12.71 IC23.11 | 81.38,11.44 101.7,11.44 102.97,12.71 IC29.11 | IC17.31 85.82,62.88 83.28,60.34 61.69,60.34 57.25,55.89 IC21.22 | v30.58,19.7 30.58,20.33 28.04,22.87 28.04,43.83 26.77,45.1 26.77,58.43 34.39,58.43 IC24.33
  Bottom 0.254: IC24.33 36.93,58.43 38.2,57.16 53.44,57.16 54.71,55.89 IC21.22 | v30.58,19.7 v36.29,13.98
D1  (via drill 0.61)
  Top 0.254: IC23.12 82.65,10.17 81.38,8.9 66.14,8.9 64.87,10.17 IC22.12 62.96,9.54 59.79,6.36 43.28,6.36 v42.64,7 | IC17.30 89,62.24 85.82,59.07 66.14,59.07 60.42,53.35 57.25,53.35 IC21.21 | v25.5,20.33 25.5,40.65 24.86,41.29 24.86,60.97 33.12,60.97 34.39,59.7 36.93,59.7 37.56,59.07 37.56,56.53 36.29,56.53 IC24.32
  Bottom 0.254: IC29.12 102.97,10.17 102.33,9.54 101.06,9.54 100.43,8.9 97.89,8.9 96.62,10.17 85.19,10.17 IC23.12 | IC24.32 36.93,55.89 38.2,54.62 53.44,54.62 54.71,53.35 IC21.21 | v42.64,7 40.74,8.9 36.93,8.9 v25.5,20.33
D2  (via drill 0.61)
  Top 0.254: IC22.13 64.87,7.63 66.14,6.36 80.11,6.36 81.38,7.63 82.65,7.63 IC23.13 85.19,7.63 85.82,7.63 87.09,6.36 101.7,6.36 102.97,7.63 IC29.13 105.51,7.63 114.4,16.52 120.75,16.52 123.29,19.06 123.29,41.92 109.32,41.92 108.05,40.65 99.79,40.65 94.71,45.73 v94.08,45.73 | v86.46,60.97 85.19,59.7 62.33,59.7 57.25,54.62 54.71,54.62 v53.44,53.35
  Bottom 0.254: 53.44,52.08 38.2,52.08 36.93,53.35 IC24.31 | 53.44,52.08 54.71,50.81 IC21.20 | 89,60.97 90.9,62.88 IC17.29 | 89,60.97 v86.46,60.97 | v53.44,53.35 53.44,52.08 | v94.08,45.73 95.35,47 95.35,54.62 89,60.97
D3  (via drill 0.61)
  Top 0.254: IC22.15 80.11,5.09 81.38,6.36 85.82,6.36 87.09,5.09 97.89,5.09 IC23.15 | v43.28,48.27 52.17,57.16 57.25,57.16 61.06,60.97 82.01,60.97 v82.65,61.61 | v83.92,68.59 86.46,71.13 v87.73,71.13
  Bottom 0.254: IC21.19 54.71,48.27 54.07,48.91 43.91,48.91 v43.28,48.27 42.01,47 39.47,47 36.29,50.18 IC24.30 | IC23.15 100.43,5.09 101.7,6.36 116.94,6.36 118.21,5.09 IC29.15 120.75,5.09 122.65,7 125.19,7 125.19,48.27 123.92,49.54 123.29,49.54 118.21,54.62 113.13,54.62 108.68,59.07 108.05,59.07 108.05,66.69 107.41,67.32 106.14,67.32 105.51,66.69 97.25,66.69 94.71,64.15 IC17.28 94.08,64.78 v87.73,71.13 | v82.65,61.61 82.65,68.59 v83.92,68.59
D4  (via drill 0.61)
  Top 0.254: IC24.29 36.93,48.27 38.2,47 42.01,47 42.64,46.37 54.07,46.37 54.71,45.73 IC21.18 56.61,46.37 61.06,50.81 62.96,50.81 v66.14,53.99 | 96.62,54.62 v96.62,57.16 | v73.12,54.62 96.62,54.62 | 96.62,54.62 v110.59,54.62
  Bottom 0.254: IC22.16 80.11,7.63 81.38,8.9 96.62,8.9 97.89,7.63 IC23.16 100.43,7.63 101.7,8.9 116.94,8.9 118.21,7.63 IC29.16 120.11,8.27 124.56,12.71 124.56,47 122.65,47 118.84,50.81 118.84,52.08 114.4,52.08 111.86,54.62 v110.59,54.62 | v96.62,57.16 96.62,62.24 IC17.27 | v73.12,54.62 72.49,53.99 v66.14,53.99
D5  (via drill 0.61)
  Top 0.254: v97.89,57.8 97.25,58.43 80.74,58.43 v78.2,55.89 | v31.85,43.19 34.39,45.73 IC24.28
  Bottom 0.254: 96.62,11.44 81.38,11.44 80.11,10.17 IC22.17 78.2,9.54 74.39,5.73 74.39,1.92 48.36,1.92 47.72,2.55 47.72,16.52 36.93,16.52 30.58,22.87 19.78,22.87 18.51,24.14 18.51,29.22 21.69,29.22 31.85,39.38 v31.85,43.19 | 96.62,11.44 97.89,10.17 IC23.17 | 96.62,11.44 116.94,11.44 118.21,10.17 IC29.17 | IC24.28 36.93,45.73 38.2,44.46 53.44,44.46 54.71,43.19 IC21.17 56.61,42.56 57.88,42.56 57.88,40.02 59.15,38.75 60.42,38.75 60.42,41.92 62.96,44.46 64.87,44.46 64.87,49.54 66.14,50.81 73.12,50.81 v78.2,55.89 | v97.89,57.8 99.16,57.8 99.16,62.24 IC17.26
D6  (via drill 0.61)
  Top 0.254: IC22.18 80.11,12.71 81.38,13.98 85.19,13.98 86.46,12.71 97.89,12.71 IC23.18 | v42.64,36.84 50.9,36.84 54.71,40.65 IC21.16 57.25,40.65 58.52,41.92 64.23,41.92 64.87,42.56 66.14,42.56 69.31,39.38 74.39,39.38 77.57,42.56 80.11,42.56 80.11,49.54 84.55,53.99 95.98,53.99 v96.62,53.35 | v38.2,38.11 38.2,42.56 36.29,42.56 IC24.27 36.29,43.83 37.56,43.83 37.56,46.37 36.93,47 33.12,47 v33.12,49.54 | v29.94,59.7 26.13,59.7 26.13,44.46 27.4,43.19 27.4,22.24 29.31,20.33 29.31,8.9 36.93,1.28 106.78,1.28 118.21,12.71 IC29.18
  Bottom 0.254: IC29.18 118.21,12.71 116.94,13.98 101.7,13.98 100.43,12.71 IC23.18 | v42.64,36.84 39.47,36.84 v38.2,38.11 | v96.62,53.35 99.79,53.35 99.79,57.8 101.7,59.7 101.7,62.24 IC17.25 | v29.94,59.7 29.94,52.08 30.58,52.08 v33.12,49.54
D7  (via drill 0.61)
  Top 0.254: 118.84,52.08 118.84,48.91 v118.21,48.91 | 118.84,52.08 118.84,53.99 118.21,54.62 113.13,54.62 113.13,57.16 111.86,58.43 109.32,58.43 104.87,62.88 IC17.24 | v64.87,41.29 59.15,41.29 56.61,38.75 IC21.15 | v94.08,52.72 94.71,52.08 118.84,52.08
  Bottom 0.254: IC24.26 36.93,40.65 38.2,39.38 53.44,39.38 54.71,38.11 IC21.15 | IC22.19 80.11,15.25 81.38,13.98 96.62,13.98 97.89,15.25 IC23.19 100.43,15.25 101.7,16.52 116.94,16.52 118.21,15.25 IC29.19 120.11,15.89 123.92,15.89 123.92,38.75 118.21,44.46 v118.21,48.91 | v64.87,41.29 65.5,41.92 69.31,41.92 69.95,42.56 69.95,43.19 70.58,43.19 71.85,44.46 85.19,44.46 87.73,47 87.73,52.72 v94.08,52.72
E  (via drill 0.61)
  Top 0.254: v52.8,34.3 54.07,35.57 54.71,35.57 IC21.14 | IC18.9 123.92,53.99 123.92,55.26 IC18.10 | v58.52,69.86 57.88,69.86 57.88,74.31 54.07,78.12 IC2.3 | v111.86,57.16 111.22,57.8 99.16,57.8 95.98,60.97 91.54,60.97 90.27,62.24 90.27,65.42 80.74,65.42 79.47,64.15 IC17.34 | v69.95,44.46 v69.95,55.26
  Bottom 0.254: v52.8,34.3 39.47,34.3 36.29,37.48 IC24.25 | v58.52,69.86 59.79,71.13 IC2.9 61.69,70.5 64.87,67.32 75.03,67.32 78.2,64.15 IC17.34 78.2,62.88 76.93,61.61 76.3,61.61 v69.95,55.26 | v111.86,57.16 122.02,57.16 123.29,55.89 IC18.10 | v69.95,44.46 66.77,44.46 64.23,41.92 63.6,41.92 63.6,40.65 59.15,36.21 57.88,36.21 57.25,35.57 IC21.14
EP
  Top 0.254: IC28.4 52.17,15.25 57.25,15.25 IC28.13
GND  (via drill 0.61)
  Top 0.508: IC29.14 102.97,5.09 101.7,3.82 86.46,3.82 85.19,5.09 IC23.14 82.65,5.09 81.38,3.82 74.39,3.82 73.12,5.09 64.87,5.09 IC22.14 62.33,5.09 61.06,3.82 48.36,3.82 | BYP19.2 40.74,26.05 40.74,27.32 R13.1 | IC28.1 51.53,23.51 52.8,24.78 53.44,24.78 BYP28.2 | IC27.7 14.07,5.09 17.88,1.28 23.59,1.28 27.4,5.09 C6.2 28.04,5.73 28.04,7 C4.2 28.04,8.27 28.04,9.54 C5.2 | 48.36,3.82 49.63,5.09 IC28.8 | 48.36,3.82 40.74,3.82 39.47,5.09 IC19.8 | 109.95,71.77 114.4,71.77 COM.G2 118.21,74.31 122.02,78.12 C3.2 | 109.95,71.77 COM.5 109.95,71.77 | IC2.11 62.33,76.21 65.5,76.21 C7.2 66.14,76.85 68.04,78.75 68.68,78.75 70.58,80.66 IC20.15 71.85,81.93 73.12,83.2 82.01,83.2 83.28,81.93 IC20.10 83.92,80.02 85.82,78.12 | C11.2 76.93,68.59 78.2,67.32 85.82,67.32 89.63,71.13 COM.G1 | 85.82,78.12 89.63,74.31 90.27,74.31 COM.G1 | RS-232.2 99.16,67.32 97.89,66.05 95.98,66.05 91.54,70.5 COM.G1 | 109.95,71.77 109.95,78.12 85.82,78.12 | BYP24.2 20.42,78.12 20.42,76.85 IC24.1 19.15,76.21 16.61,76.21 IC25.19 14.7,76.85 14.07,76.85 10.26,80.66 BYP25.2 | JP3.1 9.62,26.05 8.35,27.32 IC26.10 8.35,28.59 13.43,33.67 13.43,48.27 14.07,48.27 IC26.19 14.7,48.91 10.89,52.72 10.26,52.72 BYP26.2 10.26,53.99 8.99,55.26 8.35,55.26 IC25.10 6.45,55.89 5.81,55.89 CORE-IO.10 | BYP18.2 115.03,50.81 115.67,50.81 IC18.7 116.94,50.18 116.94,48.27 JP1.1 | BYP29.2 113.76,40.65 111.86,40.65 111.22,40.02 99.16,40.02 97.25,41.92 BYP23.2 95.98,41.92 95.35,42.56 v90.9,42.56 | 40.74,66.05 40.74,64.15 BYP21.2 | 40.74,66.05 40.74,67.96 QG1.7 | 40.74,66.05 52.8,66.05 BYP2.2 | BYP22.2 73.12,40.65 69.31,40.65 66.77,43.19 64.23,43.19 BYP17.2 62.96,43.19 62.33,43.83 v61.06,43.83
  Top 0.508: IC21.23 57.25,58.43 60.42,61.61 64.23,61.61 65.5,62.88 IC17.39
  Bottom 0.508: BYP19.2 41.37,25.41 42.64,24.14 48.36,24.14 49.63,22.87 IC28.1 | IC19.8 36.93,5.09 28.67,5.09 C6.2 | BYP28.2 54.07,25.41 55.34,24.14 59.79,24.14 60.42,23.51 60.42,13.98 57.25,13.98 56.61,13.35 56.61,5.73 51.53,5.73 IC28.8 | BYP20.2 66.14,74.31 66.14,75.58 C7.2 | 9.62,72.4 10.26,72.4 10.89,73.04 | 9.62,72.4 6.45,72.4 5.18,71.13 JP4.1 | 10.89,73.04 14.07,76.21 IC25.19 | BYP27.2 15.97,25.41 17.88,27.32 17.88,29.22 12.8,29.22 10.26,26.68 JP3.1 | CORE-IO.11 3.27,53.35 5.18,55.26 CORE-IO.10 | 9.62,72.4 9.62,56.53 8.35,56.53 IC25.10 | BYP29.2 114.4,41.29 114.4,46.37 116.3,46.37 JP1.1 | IC21.1 40.74,61.61 40.74,62.88 BYP21.2 | 61.69,51.45 57.88,55.26 57.88,57.8 56.61,57.8 IC21.23 54.71,58.43 50.9,58.43 50.9,61.61 53.44,64.15 53.44,65.42 BYP2.2 | 61.69,51.45 63.6,49.54 IC17.1 63.6,47 63.6,46.37 v61.06,43.83 | v90.9,42.56 90.27,41.92 75.66,41.92 74.39,40.65 BYP22.2 | 10.89,73.04 14.07,69.86 38.83,69.86 40.1,68.59 QG1.7 | 61.69,51.45 71.85,51.45 77.57,57.16 80.11,57.16 80.11,64.78 79.47,65.42 78.84,65.42 76.3,67.96 C11.2 | IC27.7 12.16,4.46 12.16,3.82 10.89,2.55 9.62,2.55 3.91,8.27 3.91,27.95 6.45,27.95 IC26.10
N$1
  Bottom 0.254: COM.6 100.43,73.04 101.06,72.4 106.14,72.4 106.78,71.77 COM.4
N$2
  Top 0.254: QG1.8 48.36,69.23 52.17,73.04 52.8,73.04 IC2.5
  Bottom 0.254: IC2.1 52.8,83.2 51.53,81.93 51.53,74.31 52.8,74.31 IC2.5
N$3
  Top 0.254: IC2.10 60.42,74.31 59.15,75.58 59.15,81.29 59.79,81.29 IC2.13
N$5
  Top 0.254: IC25.18 16.61,73.67 19.15,73.67 IC24.2
N$6
  Top 0.254: IC18.5 116.3,56.53 116.3,57.8 IC18.4 116.3,59.07 116.3,60.34 IC18.3
N$7  (via drill 0.61)
  Top 0.254: v57.88,81.29 58.52,81.29 58.52,71.13 60.42,69.23 IC2.8
  Bottom 0.254: v57.88,81.29 59.79,83.2 60.42,83.2 IC2.14
N$21
  Top 0.254: R1.1 112.49,68.59 121.38,68.59 C3.1
  Bottom 0.254: IC18.1 118.21,66.05 120.75,68.59 121.38,68.59 C3.1
N$22
  Top 0.254: JP1.2 119.48,48.27 119.48,62.88 117.57,62.88 IC18.2
  Bottom 0.254: R2.1 114.4,65.42 115.67,64.15 116.3,64.15 IC18.2
N$23  (via drill 0.61)
  Top 0.254: v30.58,21.6 30.58,33.03 28.67,34.94 28.67,44.46 27.4,45.73 27.4,48.91 31.21,48.91 34.39,52.08 38.2,52.08 39.47,53.35 IC21.4 40.1,53.99 40.1,55.26 IC21.3
  Bottom 0.254: v30.58,21.6 18.51,21.6 18.51,15.89 13.43,10.81 IC27.5
N$24
  Bottom 0.254: IC26.18 15.97,46.37 18.51,48.91 18.51,53.35 19.15,53.35 IC24.10
N$25
  Top 0.254: IC26.17 15.97,43.83 18.51,46.37 18.51,50.81 19.15,50.81 IC24.11
N$27
  Top 0.254: IC27.2 11.53,17.79 10.89,17.79 R11.A | IC27.6 11.53,7.63 9.62,9.54 8.35,9.54 R11.S
  Bottom 0.254: C6.1 22.96,5.73 22.32,6.36 15.34,6.36 14.07,7.63 IC27.6 | R11.A 10.26,16.52 7.72,13.98 7.72,11.44 R11.S
N$28
  Top 0.254: R9.1 22.32,2.55 21.05,2.55 R10.2 20.42,3.19 19.78,3.19 14.07,8.9 11.53,8.9 10.89,9.54 10.89,13.35 11.53,13.98 14.7,13.98 14.7,18.43 13.43,19.7 IC27.1
N$94
  Bottom 0.254: IC26.16 15.97,41.29 17.24,42.56 17.24,46.37 19.15,48.27 IC24.12
N$124
  Bottom 0.254: IC26.15 15.97,38.75 17.88,40.65 17.88,45.73 19.15,45.73 IC24.13
N$125
  Bottom 0.254: IC26.14 15.97,36.21 18.51,38.75 18.51,43.19 19.15,43.19 IC24.14
N$126
  Top 0.254: IC26.13 15.97,33.67 17.88,35.57 17.88,40.65 19.15,40.65 IC24.15
N$127
  Top 0.254: IC26.12 15.97,31.13 17.24,32.4 17.24,33.67 18.51,34.94 18.51,38.11 19.15,38.11 IC24.16
N$128
  Top 0.254: IC26.11 15.97,28.59 17.88,30.49 17.88,33.03 19.78,34.94 IC24.17
N$129
  Top 0.254: IC25.17 16.61,71.13 19.15,71.13 IC24.3
N$130
  Top 0.254: IC25.16 16.61,68.59 19.15,68.59 IC24.4
N$131
  Top 0.254: IC25.15 16.61,66.05 19.15,66.05 IC24.5
N$132
  Top 0.254: IC25.14 16.61,63.51 19.15,63.51 IC24.6
N$133
  Top 0.254: IC25.13 16.61,60.97 19.15,60.97 IC24.7
N$134
  Top 0.254: IC25.12 16.61,58.43 19.15,58.43 IC24.8
N$135
  Top 0.254: IC25.11 16.61,55.89 19.15,55.89 IC24.9
N$136
  Bottom 0.254: IC26.1 8.35,50.18 13.43,45.1 13.43,31.76 17.88,31.76 19.15,30.49 IC24.19
N$137
  Bottom 0.254: IC25.1 8.99,78.75 10.26,80.02 16.61,80.02 18.51,78.12 18.51,74.94 33.12,74.94 34.39,73.67 IC24.39
N$138  (via drill 0.61)
  Top 0.254: v26.13,41.29 26.77,41.29 26.77,9.54 23.59,6.36 21.69,6.36 21.05,7 IC27.9 | v26.13,63.51 26.13,76.21 34.39,76.21 IC24.40
  Bottom 0.254: v26.13,41.29 v26.13,63.51
N$140
  Top 0.254: C4.1 23.59,7.63 25.5,9.54 R4.1 25.5,10.81 24.86,10.81 21.05,14.62 IC27.12
  Bottom 0.254: IC27.8 21.05,4.46 21.69,3.82 23.59,3.82 24.23,4.46 24.23,7 22.96,7 C4.1
N$141
  Top 0.254: IC27.13 21.69,17.79 22.32,17.79 R3.1 23.59,17.79 24.86,17.79 R4.2
N$142
  Bottom 0.254: IC27.11 21.69,12.71 24.23,15.25 27.4,15.25 C5.1
N$143
  Top 0.254: R10.1 12.16,2.55 10.89,3.82 10.26,3.82 R11.E
N$145
  Top 0.254: COM.7 103.6,73.67 104.87,73.67 COM.8
N$147  (via drill 0.61)
  Top 0.254: v48.36,58.43 41.37,51.45 IC21.5 | v108.68,67.32 110.59,65.42 113.13,65.42 113.76,64.78 122.02,64.78 123.29,63.51 IC18.13 123.92,62.88 123.92,61.61 IC18.12
  Bottom 0.254: v48.36,58.43 47.72,59.07 43.91,59.07 42.64,60.34 42.64,76.85 44.55,76.85 51.53,83.83 51.53,85.1 99.16,85.1 111.22,73.04 111.22,69.86 v108.68,67.32
N$148
  Top 0.254: LED1.K 123.29,48.91 122.02,50.18 122.02,58.43 123.29,58.43 IC18.11
N$149
  Top 0.254: R12.1 122.02,43.83 123.29,45.1 LED1.A
N$150  (via drill 0.61)
  Top 0.254: R13.2 48.99,27.95 49.63,27.95 JP2.1 | v30.58,50.81 34.39,54.62 36.93,54.62 39.47,57.16 42.01,57.16 45.82,60.97 54.71,60.97 IC21.24
  Bottom 0.254: v30.58,50.81 30.58,44.46 36.93,44.46 39.47,41.92 52.17,41.92 54.71,39.38 57.25,39.38 57.88,38.75 57.88,36.84 54.71,36.84 54.07,36.21 54.07,34.3 57.25,34.3 57.88,33.67 57.88,28.59 51.53,28.59 JP2.1
N$151  (via drill 0.61)
  Top 0.254: v73.12,3.19 107.41,3.19 118.21,13.98 120.75,13.98 124.56,17.79 124.56,50.18 IC18.8
  Bottom 0.254: v73.12,3.19 72.49,2.55 48.99,2.55 48.99,8.27 49.63,8.9 52.8,8.9 52.8,14.62 57.88,19.7 IC28.15
N$153
  Top 0.254: IC20.7 84.55,73.04 85.82,73.04 IC20.8
N$154  (via drill 0.61)
  Top 0.254: v83.28,83.83 81.38,85.74 47.09,85.74 43.91,82.56 9.62,82.56 8.99,81.93 1.37,81.93 1.37,23.51 8.99,15.89 10.89,15.89 11.53,15.25 IC27.3
  Bottom 0.254: v83.28,83.83 68.04,83.83 66.14,81.93 C7.1
N$155
  Bottom 0.254: C9.2 80.74,71.13 79.47,72.4 78.84,72.4 IC20.5
N$156
  Top 0.254: C9.1 76.3,71.77 76.3,72.4 IC20.4
N$157
  Top 0.254: C8.2 73.76,69.23 75.03,70.5 75.03,72.4 73.76,72.4 IC20.3
N$158
  Top 0.254: C8.1 68.68,69.23 69.95,70.5 69.95,72.4 68.68,72.4 IC20.1
N$159
  Top 0.254: C11.1 81.38,69.23 80.11,70.5 80.11,73.04 80.74,73.04 IC20.6
N$160
  Top 0.254: C10.2 73.12,71.13 71.85,72.4 71.22,72.4 IC20.2
PIA-A0
  Top 0.254: IC25.2 6.45,76.21 5.18,74.94 2.64,74.94 2,74.31 2,66.69 2.64,66.69 CORE-IO.1
PIA-A1
  Top 0.254: IC25.3 7.08,73.04 5.81,71.77 5.81,66.69 5.18,66.69 CORE-IO.2
PIA-A2
  Bottom 0.254: IC25.4 7.08,70.5 3.91,67.32 3.91,65.42 2.64,64.15 CORE-IO.3
PIA-A3
  Top 0.254: IC25.5 8.35,67.96 9.62,66.69 9.62,64.78 5.81,64.78 5.18,64.15 CORE-IO.4
PIA-A4
  Bottom 0.254: IC25.6 7.08,65.42 6.45,64.78 4.54,64.78 3.91,64.15 3.91,61.61 2.64,61.61 CORE-IO.5
PIA-A5
  Top 0.254: IC25.7 7.08,62.88 5.81,61.61 5.18,61.61 CORE-IO.6
PIA-A6
  Top 0.254: IC25.8 7.08,60.34 6.45,59.7 4.54,59.7 3.27,58.43 CORE-IO.7
PIA-A7
  Top 0.254: IC25.9 6.45,58.43 5.81,58.43 CORE-IO.8
PIA-B0
  Bottom 0.254: IC26.2 7.08,48.91 6.45,49.54 4.54,49.54 3.27,50.81 CORE-IO.13
PIA-B1
  Top 0.254: IC26.3 8.35,46.37 9.62,47.64 9.62,49.54 5.81,49.54 5.18,50.18 CORE-IO.14
PIA-B2
  Top 0.254: IC26.4 7.08,43.83 6.45,44.46 4.54,44.46 3.91,45.1 3.91,47.64 2.64,47.64 CORE-IO.15
PIA-B3
  Bottom 0.254: IC26.5 8.35,41.29 9.62,42.56 9.62,47 5.81,47 5.18,47.64 CORE-IO.16
PIA-B4
  Top 0.254: IC26.6 7.08,38.75 3.91,41.92 3.91,43.83 2.64,45.1 CORE-IO.17
PIA-B5
  Bottom 0.254: IC26.7 7.08,36.21 3.91,39.38 3.91,45.73 4.54,45.73 CORE-IO.18
PIA-B6
  Top 0.254: IC26.8 7.08,33.67 2.64,38.11 2.64,42.56 CORE-IO.19
PIA-B7
  Top 0.254: IC26.9 8.35,31.13 9.62,32.4 9.62,41.92 5.81,41.92 5.18,42.56 CORE-IO.20
Q  (via drill 0.61)
  Top 0.254: v60.42,66.69 58.52,68.59 54.71,68.59 IC2.7
  Bottom 0.254: IC2.7 54.07,69.23 55.98,71.13 55.98,78.75 59.79,78.75 IC2.12 | v60.42,66.69 73.12,66.69 75.66,64.15 IC17.35
R/!W  (via drill 0.61)
  Top 0.254: IC24.21 36.93,27.95 38.2,29.22 43.28,29.22 47.09,33.03 54.71,33.03 IC21.13 57.25,33.03 61.06,36.84 64.87,36.84 66.14,35.57 77.57,35.57 IC22.27 | v83.28,50.81 83.28,50.18 82.65,49.54 v82.65,40.02
  Bottom 0.254: v83.28,50.81 83.92,50.81 83.92,62.24 IC17.32 | v82.65,40.02 80.74,38.11 80.74,36.21 79.47,36.21 IC22.27
RX  (via drill 0.61)
  Top 0.254: v44.55,60.97 42.01,58.43 IC21.2 | v68.68,77.48 70.58,79.39 76.93,79.39 78.2,80.66 IC20.12
  Bottom 0.254: v44.55,60.97 45.82,62.24 47.72,62.24 52.8,67.32 54.71,67.32 56.61,69.23 56.61,77.48 v68.68,77.48
RXD  (via drill 0.61)
  Top 0.254: v92.17,76.85 96.62,72.4 | 96.62,72.4 96.62,69.86 RS-232.3 | 96.62,72.4 102.33,72.4 103.6,71.13 COM.3
  Bottom 0.254: v92.17,76.85 80.74,76.85 76.93,80.66 IC20.13
TX  (via drill 0.61)
  Top 0.254: v52.17,59.7 41.37,48.91 IC21.6 | v62.96,72.4 65.5,74.94 67.41,74.94 69.95,77.48 77.57,77.48 80.74,80.66 IC20.11
  Bottom 0.254: v52.17,59.7 52.17,61.61 57.25,66.69 57.25,72.4 v62.96,72.4
TXD
  Top 0.254: RS-232.1 101.7,69.86 101.7,70.5 COM.2
  Bottom 0.254: IC20.14 74.39,80.66 79.47,75.58 95.98,75.58 99.16,72.4 99.79,72.4 100.43,71.77 101.06,71.77 COM.2
VCC  (via drill 0.61)
  Top 0.508: BYP26.1 15.34,52.72 15.34,51.45 IC26.20 16.61,50.81 17.88,52.08 21.69,52.08 22.32,51.45 22.32,28.59 21.05,28.59 IC24.20 20.42,27.32 20.42,26.05 BYP27.1 20.42,24.78 20.42,22.87 | CORE-IO.9 2.64,55.26 4.54,53.35 CORE-IO.12 | IC25.20 15.34,79.39 15.34,80.66 BYP25.1 15.97,81.29 22.32,81.29 24.86,78.75 BYP24.1 | BYP18.1 114.4,56.53 114.4,61.61 108.68,61.61 108.05,62.24 108.05,65.42 106.78,65.42 R2.2 106.14,66.05 104.24,67.96 R1.2 104.87,68.59 109.32,68.59 110.59,67.32 122.02,67.32 123.29,66.05 IC18.14 | 50.26,82.56 51.53,81.29 52.17,81.29 IC2.2 | 50.26,82.56 48.99,83.83 QG1.14 | 50.26,82.56 67.41,82.56 68.04,81.93 IC20.16 | C10.1 68.68,70.5 66.77,68.59 BYP20.1 65.5,68.59 62.96,66.05 61.69,66.05 61.06,65.42 58.52,65.42 BYP2.1 57.88,66.05 55.34,63.51 46.45,63.51 BYP21.1 | IC2.4 54.07,75.58 55.34,74.31 55.34,71.77 54.07,71.77 IC2.6 | 20.42,22.87 20.42,20.97 IC27.14 19.78,19.7 18.51,18.43 18.51,10.17 | 20.42,22.87 5.81,22.87 R14.2 | R3.2 22.32,10.17 21.69,10.17 IC27.10 19.15,10.17 18.51,10.17 | 18.51,10.17 16.61,10.17 14.07,12.71 IC27.4 | IC29.28 119.48,38.75 119.48,40.02 BYP29.1 | R12.2 122.02,36.21 120.75,37.48 120.11,37.48 IC29.28 | BYP22.1 78.84,40.02 78.84,38.75 IC22.28 80.11,38.11 82.65,38.11 IC23.1 | IC23.27 98.52,36.21 98.52,37.48 IC23.28 | IC23.28 100.43,38.11 102.97,38.11 IC29.1 105.51,38.11 118.21,38.11 IC29.28 | IC23.1 85.19,38.11 97.89,38.11 IC23.28 | IC17.7 78.84,47 78.84,46.37 R8.2 78.2,45.73 75.66,43.19 69.31,43.19 BYP17.1 68.04,43.19 65.5,45.73 61.69,45.73 R6.2 60.42,45.73 59.15,44.46 43.28,44.46 42.01,43.19 IC21.8 41.37,42.56 42.64,41.29 42.64,38.75 41.37,38.75 IC21.10 40.1,37.48 38.2,35.57 36.93,35.57 IC24.24
  Top 0.508: IC24.22 36.93,30.49 39.47,33.03 IC21.12 | IC28.16 58.52,23.51 58.52,24.78 BYP28.1 | IC19.16 45.82,23.51 45.82,24.78 BYP19.1 45.82,26.05 45.82,30.49 47.72,30.49 R7.2 48.99,30.49 49.63,30.49 JP2.2 | v83.92,45.73 83.92,38.75 IC23.1
  Bottom 0.508: IC26.20 14.07,50.81 12.8,52.08 7.08,52.08 5.81,53.35 CORE-IO.12 | IC25.20 14.07,78.75 12.8,77.48 4.54,77.48 4.54,74.31 JP4.2 2.64,73.67 1.37,73.67 1.37,57.8 2.64,56.53 CORE-IO.9 | BYP21.1 45.82,64.15 52.17,70.5 52.8,70.5 IC2.6 | R5.2 61.06,56.53 61.06,65.42 58.52,65.42 BYP2.1 | IC2.2 54.07,80.66 55.34,79.39 55.34,76.85 54.07,76.85 IC2.4 | 48.99,85.1 48.36,84.47 QG1.14 | 48.99,85.1 50.26,86.37 100.43,86.37 104.87,81.93 123.92,81.93 123.92,66.69 IC18.14 | 48.99,85.1 32.48,85.1 26.13,78.75 BYP24.1 | R9.2 29.94,2.55 28.67,3.82 27.4,3.82 24.86,6.36 24.86,8.9 23.59,10.17 R3.2 | BYP23.1 101.7,41.29 99.16,38.75 IC23.28 | IC24.24 36.93,35.57 39.47,33.03 IC21.12 42.01,33.03 44.55,30.49 47.72,30.49 R7.2 | IC28.16 57.25,22.87 53.44,22.87 50.9,25.41 46.45,25.41 BYP19.1 | v83.92,45.73 79.47,45.73 R8.2 | BYP27.1 21.05,25.41 22.32,24.14 35.66,24.14 37.56,26.05 37.56,29.86 36.29,29.86 IC24.22

### Text on the board
Top: Component Side
Bottom: PA8PDP/VRS | Solder side
tPlace: + | RealConsole CORE - Rev.1
tValues: + | -